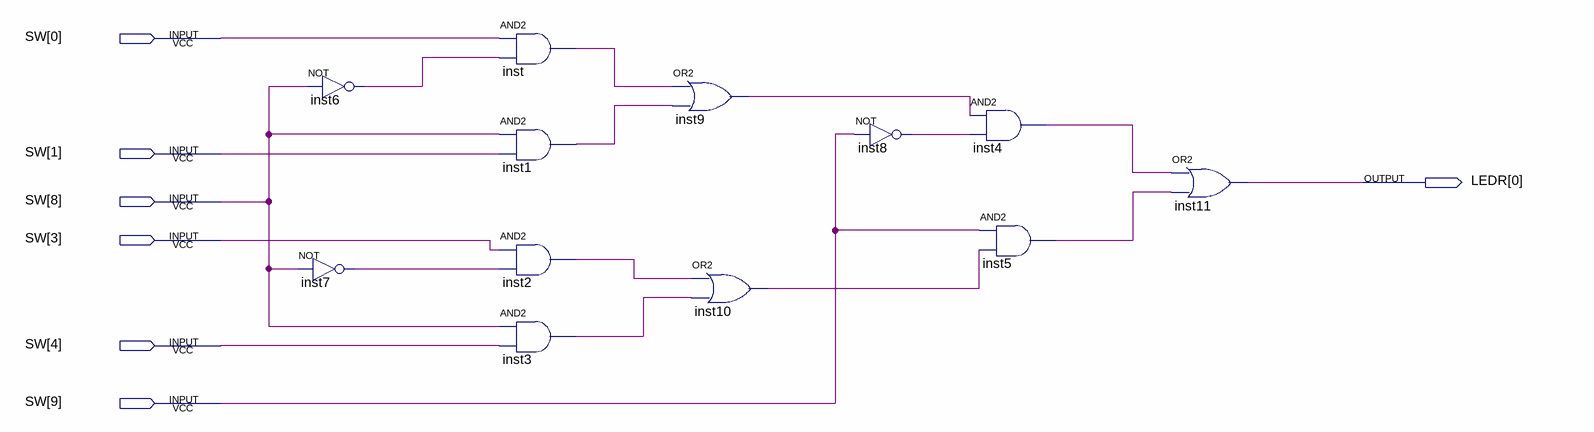
[diagram p0: schematic sheet]
// Quartus schematic 4mux.bdf as structural Verilog: 12 symbols, 7 pins
module \4mux  (
  input  [9:0] SW,
  output [0:0] LEDR
);

  wire inst1_out, inst2_out, inst3_out, inst4_out, inst5_out, inst6_out, inst7_out, inst8_out, inst9_out,
       inst10_out, inst_out;

  not inst6 (inst6_out, SW[8]);
  not inst7 (inst7_out, SW[8]);
  and inst (inst_out, SW[0], inst6_out);
  and inst1 (inst1_out, SW[8], SW[1]);
  and inst2 (inst2_out, SW[3], inst7_out);
  and inst3 (inst3_out, SW[8], SW[4]);
  or inst9 (inst9_out, inst_out, inst1_out);
  or inst10 (inst10_out, inst2_out, inst3_out);
  not inst8 (inst8_out, SW[9]);
  and inst4 (inst4_out, inst9_out, inst8_out);
  and inst5 (inst5_out, SW[9], inst10_out);
  or inst11 (LEDR[0], inst4_out, inst5_out);
endmodule
